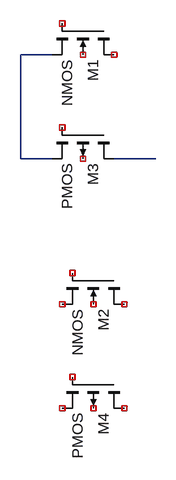
[diagram p0: schematic Draft7.asc]
Draft7.asc, the LTspice schematic file:
Version 4
SHEET 1 880 720
WIRE 208 96 160 96
WIRE 160 256 160 96
WIRE 208 256 160 256
WIRE 368 256 304 256
SYMBOL nmos4 304 48 R90
SYMATTR InstName M1
SYMBOL nmos4 320 432 R90
SYMATTR InstName M2
SYMBOL pmos4 304 208 R90
SYMATTR InstName M3
SYMBOL pmos4 320 592 R90
SYMATTR InstName M4

The netlist it stands for:
* Draft7.asc
M1 NC_01 NC_02 N001 NC_03 NMOS
M2 NC_04 NC_05 NC_06 NC_07 NMOS
M3 N002 NC_08 N001 NC_09 PMOS
M4 NC_10 NC_11 NC_12 NC_13 PMOS
.model NMOS NMOS
.model PMOS PMOS
.lib standard.mos
.backanno
.end